# EAGLE design tester (EAGLE 9.4.2)
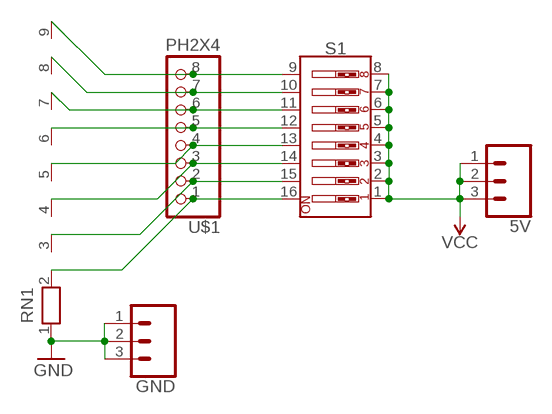
[diagram p0: schematic, sheet 1]

## Parts
5V  CONN_03  [1X03]
GND  CONN_03  [1X03]
RN1  RN08  [RN-9]
S1  DIP-08-PTH  [DIPSWITCH-08]
U$1  PH2X4  [2X04]

## Nets
GND: GND.1 GND.2 GND.3 RN1.1
N$1: RN1.2 S1.16 U$1.1
N$2: RN1.3 S1.15 U$1.2
N$3: RN1.4 S1.14 U$1.3
N$4: RN1.5 S1.13 U$1.4
N$5: RN1.6 S1.12 U$1.5
N$6: RN1.7 S1.11 U$1.6
N$7: RN1.8 S1.10 U$1.7
N$8: RN1.9 S1.9 U$1.8
VCC: 5V.1 5V.2 5V.3 S1.1 S1.2 S1.3 S1.4 S1.5 S1.6 S1.7 S1.8

## Library data of the parts
5V GND = SparkFun-Connectors:CONN_03: Multi connection point. Often used as Generic Header-pin footprint for 0.1 inch spaced/style header connections On any of the 0.1 inch spaced packages, you can populate with these: Break Away Headers - Straight <https://www.sparkfun.com/products/116> (PRT-00116) Break Away Male Headers - Right Angle <https://www.sparkfun.com/products/553> (PRT-00553) Female Headers <https://www.sparkfun.com/products/115> (PRT-00115) Break Away Headers - Machine Pin <https://www.sparkfun.com/products/117> (PRT-00117) Break Away Female Headers - Swiss Machine Pin <https://www.sparkfun.com/products/743> (PRT-00743) Stackable Header - 3 Pin (Female, 0.1") <https://www.sparkfun.com/products/13875> (PRT-13875) For SCREWTERMINALS and SPRING TERMINALS visit here: Screw Terimnals on SparkFun.com <https://www.sparkfun.com/search/results?term=Screw+Terminals> (5mm/3.5mm/2.54mm spacing) This device is also useful as a general connection point to wire up your design to another part of your project. Our various solder wires solder well into these plated through hole pads. Hook-Up Wire - Assortment (Stranded, 22 AWG) <https://www.sparkfun.com/products/11375> (PRT-11375) Hook-Up Wire - Assortment (Solid Core, 22 AWG) <https://www.sparkfun.com/products/11367> (PRT-11367) View the entire wire category on our website here <https://www.sparkfun.com/categories/141> Special notes: Molex polarized connector foot print use with SKU : PRT-08232 with associated crimp pins and housings.
RN1 = resistor-net:RN08: RESISTOR NETWORK; OC_FARNELL: unknown; OC_NEWARK: unknown
S1 = SparkFun-Switches:DIP-08: 8-Position DIP Switch 8-circuit DIP (dual inline package) switch. Commonly used to physcially set a circuit's behavior. SparkFun Products DIP Switch - 8 Position <https://www.sparkfun.com/products/8034> (COM-08034); PROD_ID: SWCH-12197; SF_SKU: COM-08034
U$1 = pinhead2:PH2X4

## Board
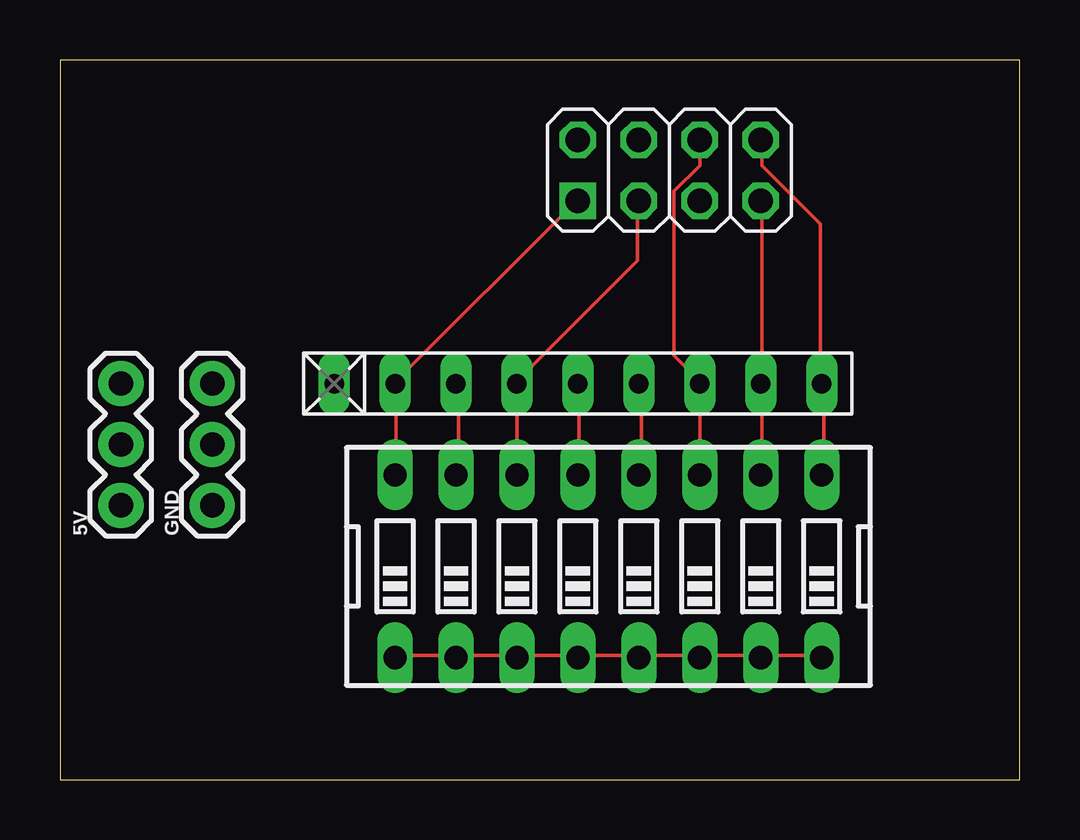
[diagram p1: board, top side]
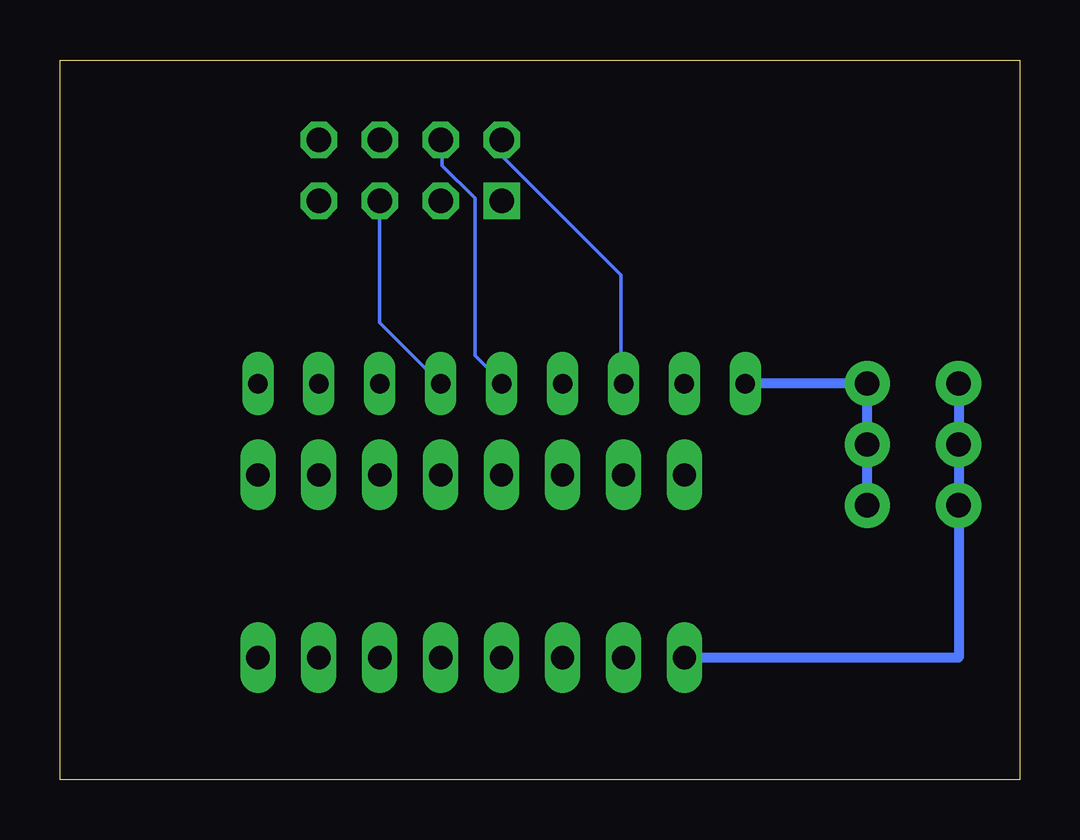
[diagram p2: board, bottom side, seen from below]

Size 40 x 30 mm. Coordinates in mm from the lower left corner, seen from the top.
Outline: 0,0 40,0 40,30 0,30 0,0
Copper layers (1*16): Top 0.035mm / dielectric 1.5mm / Bottom 0.035mm
Design rules "default": minimum track width 6mil, minimum drill 0.35mm, track to track 6mil, track to pad 6mil, pad to pad 6mil, via to via 6mil, smd to smd 6mil, copper to edge 40mil, drill to drill 6mil, minimum pad ring 10mil, minimum via ring 8mil, stop-mask expansion 4mil, vias tented up to drill 0mil, thermal gap 10mil

### Footprints (pad centres in the part's own frame; a part is rotated, then mirrored left to right if it is on the bottom)
1X03 = drill 1.016 pad 1.88: 1 0,0; 2 2.54,0; 3 5.08,0
RN-9 = drill 0.813 long: 1 -10.16,0; 2 -7.62,0; 3 -5.08,0; 4 -2.54,0; 5 0,0; 6 2.54,0; 7 5.08,0; 8 7.62,0; 9 10.16,0
DIPSWITCH-08 = drill 0.97 long: 1 -8.89,-3.81; 2 -6.35,-3.81; 3 -3.81,-3.81; 4 -1.27,-3.81; 5 1.27,-3.81; 6 3.81,-3.81; 7 6.35,-3.81; 8 8.89,-3.81; 9 8.89,3.81; 10 6.35,3.81; 11 3.81,3.81; 12 1.27,3.81; 13 -1.27,3.81; 14 -3.81,3.81; 15 -6.35,3.81; 16 -8.89,3.81
2X04 = drill 1.016 square: 1 -3.81,-1.27 | drill 1.016 octagon: 2 -3.81,1.27; 3 -1.27,-1.27; 4 -1.27,1.27; 5 1.27,-1.27; 6 1.27,1.27; 7 3.81,-1.27; 8 3.81,1.27

### Placement (x,y rotation side)
5V  2.54,11.43 90 top
GND  6.35,11.43 90 top
RN1  21.59,16.51 0 top
S1  22.86,8.89 0 top
U$1  25.4,25.4 0 top

### Tracks (layer width: path | path; a pad name or v marks a point on that pad's centre or on a via)
GND
  Bottom 0.406: GND.1 GND.2 GND.3 RN1.1
N$1
  Top 0.152: S1.16 14.02,12.8 14.02,16.46 RN1.2 14.02,16.61 21.49,24.08 U$1.1
N$2
  Top 0.152: RN1.3 16.61,16.46 16.61,12.8 S1.15
  Bottom 0.152: U$1.2 21.49,26.67 21.49,25.91 16.61,21.03 16.61,16.61 RN1.3
N$3
  Top 0.152: S1.14 RN1.4 19.05,16.61 24.08,21.64 24.08,24.08 U$1.3
N$4
  Top 0.152: RN1.5 21.64,16.46 21.64,12.8 S1.13
  Bottom 0.152: U$1.4 24.08,26.67 24.08,25.6 22.71,24.23 22.71,17.68 21.64,16.61 RN1.5
N$5
  Top 0.152: RN1.6 24.23,16.46 24.23,12.8 S1.12
  Bottom 0.152: U$1.5 26.67,19.05 RN1.6
N$6
  Top 0.152: S1.11 RN1.7 26.67,16.61 25.6,17.68 25.6,24.54 26.67,25.6 U$1.6
N$7
  Top 0.152: S1.10 29.26,12.8 29.26,16.46 RN1.8 29.26,16.61 29.26,24.08 U$1.7
N$8
  Top 0.152: S1.9 31.85,12.8 31.85,16.46 RN1.9 31.7,16.61 31.7,23.16 29.26,25.6 29.26,26.67 U$1.8
VCC
  Top 0.152: S1.1 14.02,5.18 16.46,5.18 S1.2 16.61,5.18 19.05,5.18 | S1.8 31.7,5.18 29.26,5.18 S1.7 29.11,5.18 26.67,5.18 | 26.67,5.18 24.23,5.18 S1.5 24.08,5.18 21.64,5.18 S1.4 21.49,5.18 19.05,5.18 | 26.67,5.18 S1.6 | 19.05,5.18 S1.3
  Bottom 0.406: 5V.3 5V.2 5V.1 2.54,5.08 S1.1